# Altium schematic sheet MCU.SchDoc
size A4
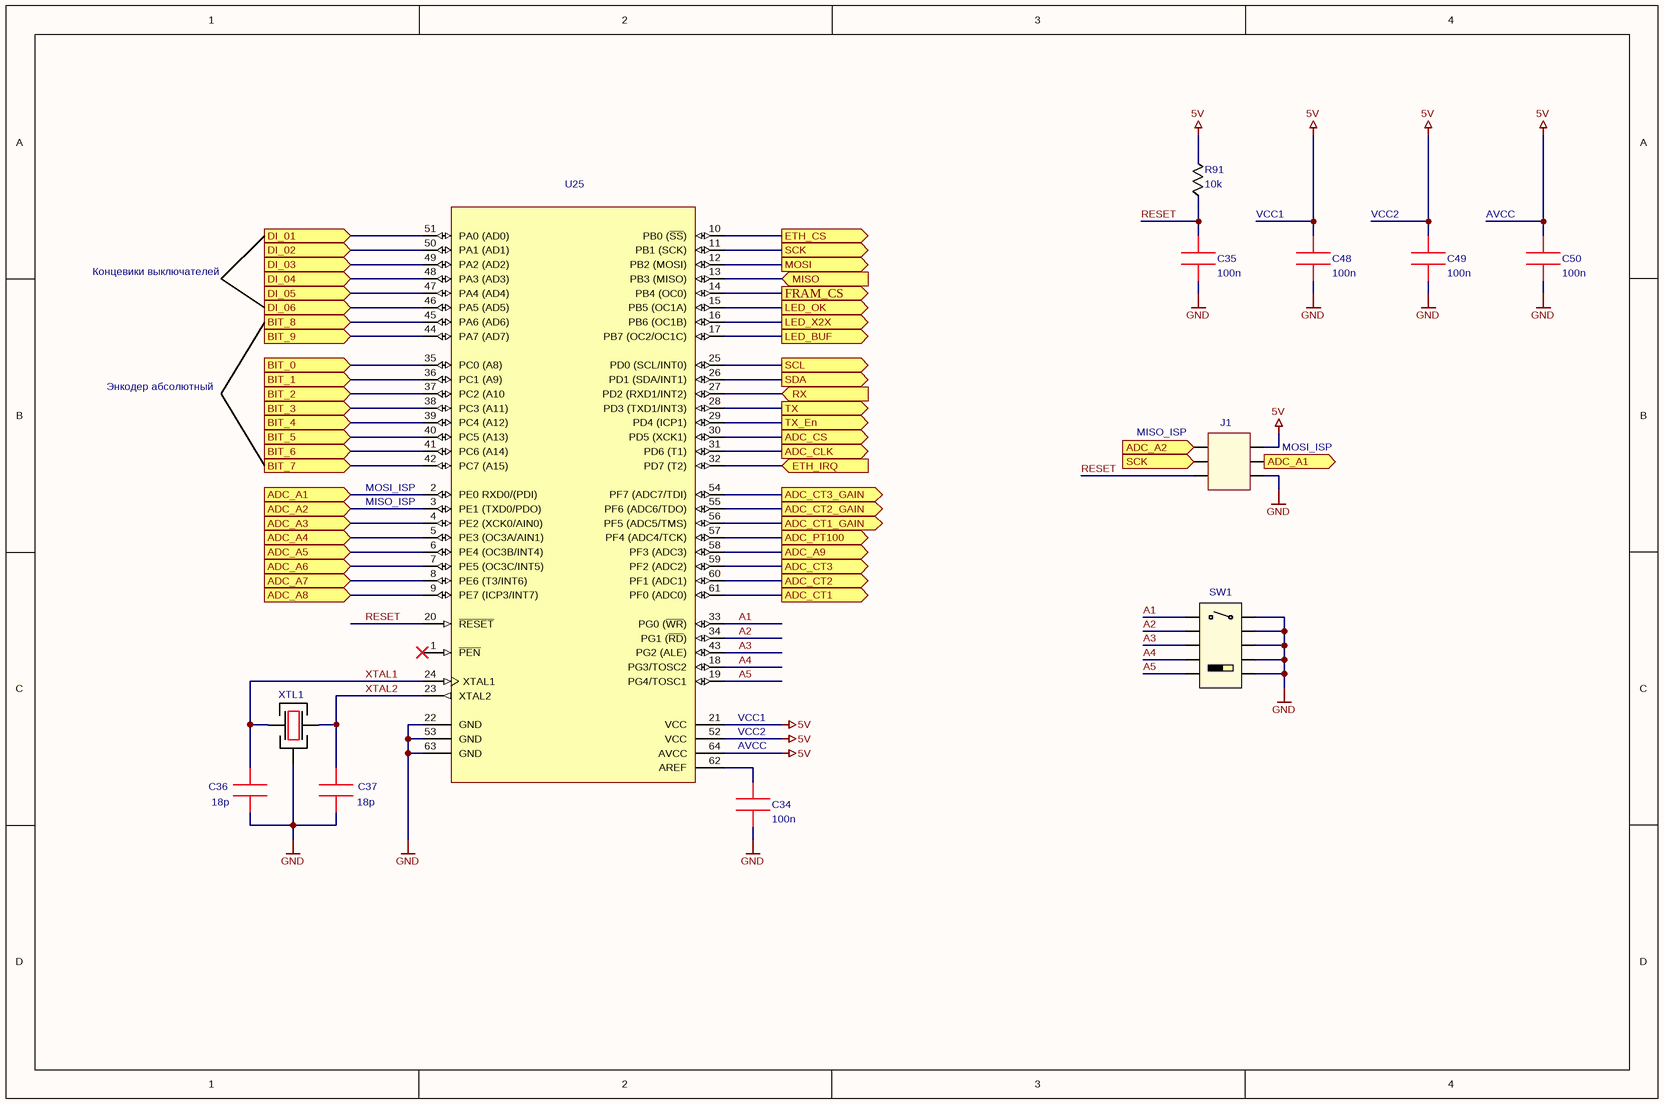
[diagram p0: MCU.SchDoc]

## Parts
C34  100n  [0603]
C35  100n  [0603]
C36  18p  [0603]
C37  18p  [0603]
C48  100n  [0603]
C49  100n  [0603]
C50  100n  [0603]
J1  Pin Line 2x3  [PLD-6 2.54]  (value not drawn)
R91  10k  [0603]
SW1  DIP-Switch 5 Pins  [Switch DIP-5]  (value not drawn)
U25  MCU  [64A_N]  (value not drawn)
XTL1  16.0 MHz  [ABM10]  (value not drawn)

## Ports
ADC_A1, ADC_A2, ADC_A3, ADC_A4, ADC_A5, ADC_A6, ADC_A7, ADC_A8, ADC_A9, ADC_CLK, ADC_CS, ADC_CT1, ADC_CT1_GAIN, ADC_CT2, ADC_CT2_GAIN, ADC_CT3, ADC_CT3_GAIN, ADC_PT100, BIT_0, BIT_1, BIT_2, BIT_3, BIT_4, BIT_5, BIT_6, BIT_7, BIT_8, BIT_9, DI_01, DI_02, DI_03, DI_04, DI_05, DI_06, ETH_CS, ETH_IRQ, FRAM_CS, LED_BUF, LED_OK, LED_X2X, MISO, MOSI, RX, SCK, SCL, SDA, TX, TX_En

## Nets
5V: C48.2 C49.2 C50.2 J1.2 R91.2 U25.21(VCC) U25.52(VCC) U25.64(AVCC)
GND: C34.1 C35.1 C36.1 C37.1 C48.1 C49.1 C50.1 J1.6 SW1.1 SW1.3 SW1.5 SW1.7 SW1.9 U25.22(GND) U25.53(GND) U25.63(GND) XTL1.2
A1: SW1.2 U25.33(PG0_(~{WR}))
A2: SW1.4 U25.34(PG1_(~{RD}))
A3: SW1.6 U25.43(PG2_(ALE))
A4: SW1.8 U25.18(PG3/TOSC2)
A5: SW1.10 U25.19(PG4/TOSC1)
ADC_A1: J1.4 U25.2(PE0_RXD0/(PDI)) ; port ADC_A1
ADC_A2: J1.1 U25.3(PE1_(TXD0/PDO)) ; port ADC_A2
ADC_A3: U25.4(PE2_(XCK0/AIN0)) ; port ADC_A3
ADC_A4: U25.5(PE3_(OC3A/AIN1)) ; port ADC_A4
ADC_A5: U25.6(PE4_(OC3B/INT4)) ; port ADC_A5
ADC_A6: U25.7(PE5_(OC3C/INT5)) ; port ADC_A6
ADC_A7: U25.8(PE6_(T3/INT6)) ; port ADC_A7
ADC_A8: U25.9(PE7_(ICP3/INT7)) ; port ADC_A8
ADC_A9: U25.58(PF3_(ADC3)) ; port ADC_A9
ADC_CLK: U25.31(PD6_(T1)) ; port ADC_CLK
ADC_CS: U25.30(PD5_(XCK1)) ; port ADC_CS
ADC_CT1: U25.61(PF0_(ADC0)) ; port ADC_CT1
ADC_CT1_GAIN: U25.56(PF5_(ADC5/TMS)) ; port ADC_CT1_GAIN
ADC_CT2: U25.60(PF1_(ADC1)) ; port ADC_CT2
ADC_CT2_GAIN: U25.55(PF6_(ADC6/TDO)) ; port ADC_CT2_GAIN
ADC_CT3: U25.59(PF2_(ADC2)) ; port ADC_CT3
ADC_CT3_GAIN: U25.54(PF7_(ADC7/TDI)) ; port ADC_CT3_GAIN
ADC_PT100: U25.57(PF4_(ADC4/TCK)) ; port ADC_PT100
BIT_0: U25.35(PC0_(A8)) ; port BIT_0
BIT_1: U25.36(PC1_(A9)) ; port BIT_1
BIT_2: U25.37(PC2_(A10) ; port BIT_2
BIT_3: U25.38(PC3_(A11)) ; port BIT_3
BIT_4: U25.39(PC4_(A12)) ; port BIT_4
BIT_5: U25.40(PC5_(A13)) ; port BIT_5
BIT_6: U25.41(PC6_(A14)) ; port BIT_6
BIT_7: U25.42(PC7_(A15)) ; port BIT_7
BIT_8: U25.45(PA6_(AD6)) ; port BIT_8
BIT_9: U25.44(PA7_(AD7)) ; port BIT_9
DI_01: U25.51(PA0_(AD0)) ; port DI_01
DI_02: U25.50(PA1_(AD1)) ; port DI_02
DI_03: U25.49(PA2_(AD2)) ; port DI_03
DI_04: U25.48(PA3_(AD3)) ; port DI_04
DI_05: U25.47(PA4_(AD4)) ; port DI_05
DI_06: U25.46(PA5_(AD5)) ; port DI_06
ETH_CS: U25.10(PB0_(~{SS})) ; port ETH_CS
ETH_IRQ: U25.32(PD7_(T2)) ; port ETH_IRQ
FRAM_CS: U25.14(PB4_(OC0)) ; port FRAM_CS
LED_BUF: U25.17(PB7_(OC2/OC1C)) ; port LED_BUF
LED_OK: U25.15(PB5_(OC1A)) ; port LED_OK
LED_X2X: U25.16(PB6_(OC1B)) ; port LED_X2X
MISO: U25.13(PB3_(MISO)) ; port MISO
MOSI: U25.12(PB2_(MOSI)) ; port MOSI
RESET: C35.2 J1.5 R91.1 U25.20(~{RESET})
RX: U25.27(PD2_(RXD1/INT2)) ; port RX
SCK: J1.3 U25.11(PB1_(SCK)) ; port SCK
SCL: U25.25(PD0_(SCL/INT0)) ; port SCL
SDA: U25.26(PD1_(SDA/INT1)) ; port SDA
TX: U25.28(PD3_(TXD1/INT3)) ; port TX
TX_En: U25.29(PD4_(ICP1)) ; port TX_En
XTAL1: C36.2 U25.24(XTAL1) XTL1.1
XTAL2: C37.2 U25.23(XTAL2) XTL1.3
NetC34_2: C34.2 U25.62(AREF)

Not connected (* = marked no-connect by the designer): U25 1(~{PEN})*

## Notes on the sheet
- VCC1
- VCC2
- AVCC
- Концевики выключателей
- Энкодер абсолютный
- (near J1) MISO_ISP
- (near J1) MOSI_ISP
- (near U25) MOSI_ISP
- (near U25) MISO_ISP
- (near U25) VCC1

## Library data of the parts
C34 C35 C48-C50 = 0603 CAP: CC0603KRX7R9BB104
C36 C37 = 0603 CAP: CC0603JRNPO9BN180
J1 = PLD-6
R91 = 0603 RES: RC0603FR-0710KL
SW1 = Switch DIP-5: DIP-Switch NDP-05
U25 = ATmega128A-AU: DatasheetVersion: revH, Feb-2011; PackageVersion: revC, Oct-2010; PackageReference: 64A; PackageDescription: 64-Pin Plastic Thin Profile Quad Flat Pack, 14 x 14 x 1.0 mm Body, 0.8 mm Pitch (TQFP); Code_JEDEC: MS-026-AEB; ComponentLink1Description: Manufacturer URL; ComponentLink1URL: http://www.atmel.com/; ComponentLink2Description: ATmega128A Datasheet; ComponentLink2URL: http://www.atmel.com/dyn/resources/prod_documents/doc8151.pdf; ComponentLink3Description: ATmega128A Summary; ComponentLink3URL: http://www.atmel.com/dyn/resources/prod_documents/8151S.pdf
XTL1 = KX-7: 12.88605